# EAGLE design picostepknobs (EAGLE 9.6.2)
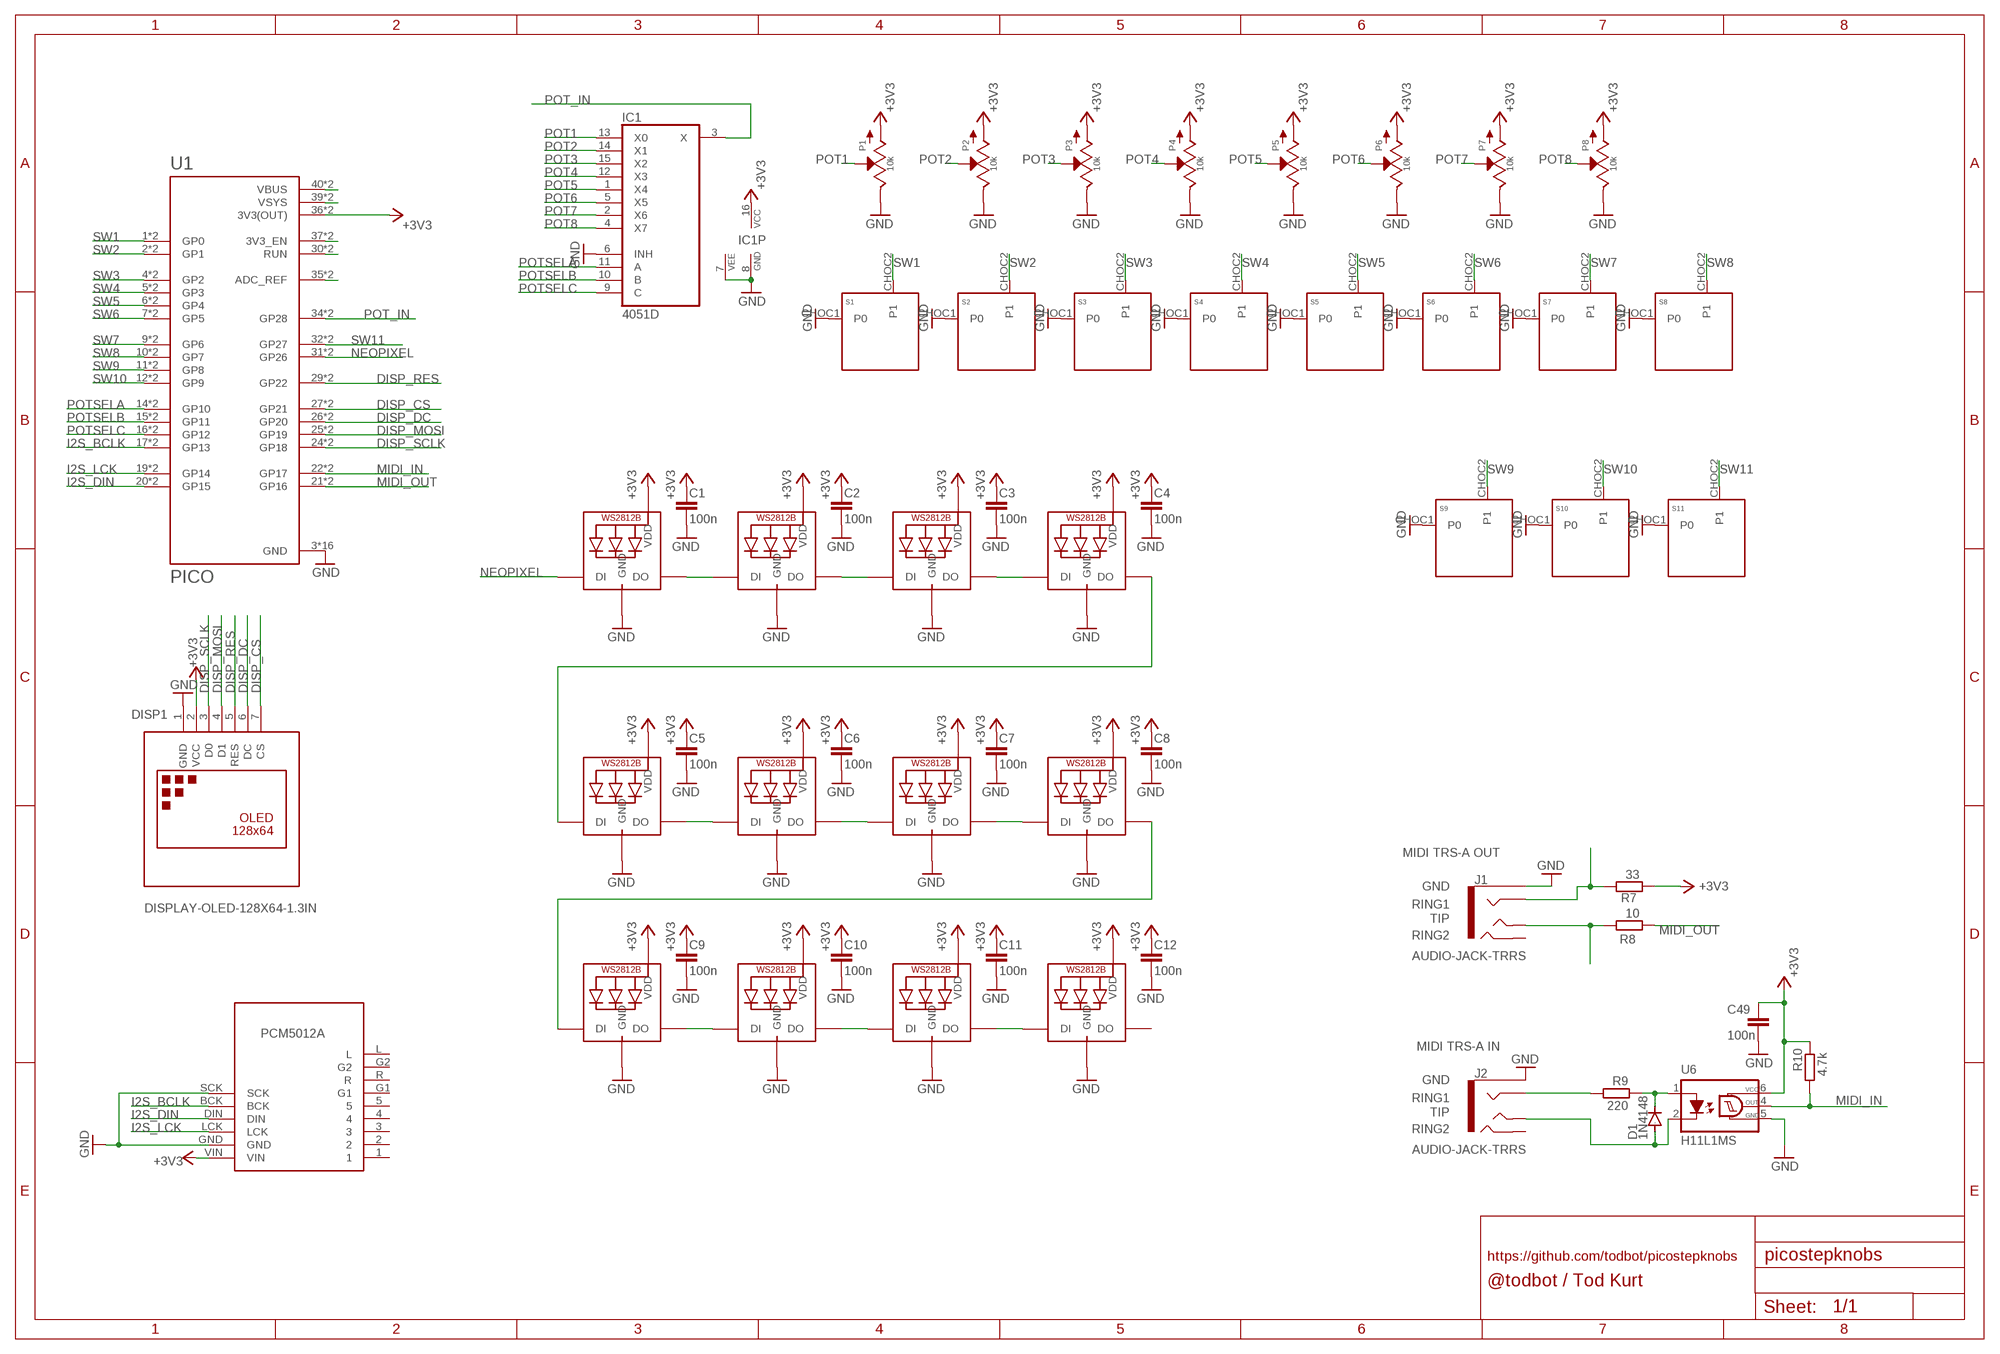
[diagram p0: schematic, sheet 1]

## Parts
C1  100n  C-EUC0805  [C0805]
C2  100n  C-EUC0805  [C0805]
C3  100n  C-EUC0805  [C0805]
C4  100n  C-EUC0805  [C0805]
C5  100n  C-EUC0805  [C0805]
C6  100n  C-EUC0805  [C0805]
C7  100n  C-EUC0805  [C0805]
C8  100n  C-EUC0805  [C0805]
C9  100n  C-EUC0805  [C0805]
C10  100n  C-EUC0805  [C0805]
C11  100n  C-EUC0805  [C0805]
C12  100n  C-EUC0805  [C0805]
C49  100n  C-EUC0805  [C0805]
D1  1N4148  DIODE-SOD123  [SOD123]
DISP1  DISPLAY-OLED-128X64-1.3IN  [DISPLAY-OLED-128X64-1.3IN]
IC1  4051D  [SO16]
J1  AUDIO-JACK-TRRS  [PJ-320D_SPARKFUN]
J2  AUDIO-JACK-TRRS  [PJ-320D_SPARKFUN]
LED1  WS2812B3535  [LED3535]
LED2  WS2812B3535  [LED3535]
LED3  WS2812B3535  [LED3535]
LED4  WS2812B3535  [LED3535]
LED5  WS2812B3535  [LED3535]
LED6  WS2812B3535  [LED3535]
LED7  WS2812B3535  [LED3535]
LED8  WS2812B3535  [LED3535]
LED9  WS2812B3535  [LED3535]
LED10  WS2812B3535  [LED3535]
LED11  WS2812B3535  [LED3535]
LED12  WS2812B3535  [LED3535]
P1  10k  POTZEPHPOT_BIGKNOB  [OG-POTS_ALPS_POT_VERTICAL_WITHBIGKNOB]
P2  10k  POTZEPHPOT_BIGKNOB  [OG-POTS_ALPS_POT_VERTICAL_WITHBIGKNOB]
P3  10k  POTZEPHPOT_BIGKNOB  [OG-POTS_ALPS_POT_VERTICAL_WITHBIGKNOB]
P4  10k  POTZEPHPOT_BIGKNOB  [OG-POTS_ALPS_POT_VERTICAL_WITHBIGKNOB]
P5  10k  POTZEPHPOT_BIGKNOB  [OG-POTS_ALPS_POT_VERTICAL_WITHBIGKNOB]
P6  10k  POTZEPHPOT_BIGKNOB  [OG-POTS_ALPS_POT_VERTICAL_WITHBIGKNOB]
P7  10k  POTZEPHPOT_BIGKNOB  [OG-POTS_ALPS_POT_VERTICAL_WITHBIGKNOB]
P8  10k  POTZEPHPOT_BIGKNOB  [OG-POTS_ALPS_POT_VERTICAL_WITHBIGKNOB]
PCM5102A  I2S_PCM_51XX_SOUNDCARD  [I2S_PCM_5100_SOUNDCARD]
R7  33  R-EU_R0805  [R0805]
R8  10  R-EU_R0805  [R0805]
R9  220  R-EU_R0805  [R0805]
R10  4.7k  R-EU_R0805  [R0805]
S1  KEYSWITCH-PLAIN-CHOC-1U  [CHOC-1U]
S2  KEYSWITCH-PLAIN-CHOC-1U  [CHOC-1U]
S3  KEYSWITCH-PLAIN-CHOC-1U  [CHOC-1U]
S4  KEYSWITCH-PLAIN-CHOC-1U  [CHOC-1U]
S5  KEYSWITCH-PLAIN-CHOC-1U  [CHOC-1U]
S6  KEYSWITCH-PLAIN-CHOC-1U  [CHOC-1U]
S7  KEYSWITCH-PLAIN-CHOC-1U  [CHOC-1U]
S8  KEYSWITCH-PLAIN-CHOC-1U  [CHOC-1U]
S9  KEYSWITCH-PLAIN-CHOC-1U  [CHOC-1U]
S10  KEYSWITCH-PLAIN-CHOC-1U  [CHOC-1U]
S11  KEYSWITCH-PLAIN-CHOC-1U  [CHOC-1U]
U1  PICO  RASPBERRY_PICO-NO_DEBUG  [PICO-PKG-NO_DEBUG]
U6  H11L1MS  [DIL6-SMD]

## Nets
+3V3: C1.1 C2.1 C3.1 C4.1 C5.1 C6.1 C7.1 C8.1 C9.1 C10.1 C11.1 C12.1 C49.1 DISP1.2(VCC) IC1.16(VCC) LED1.2(VDD) LED2.2(VDD) LED3.2(VDD) LED4.2(VDD) LED5.2(VDD) LED6.2(VDD) LED7.2(VDD) LED8.2(VDD) LED9.2(VDD) LED10.2(VDD) LED11.2(VDD) LED12.2(VDD) P1.P$3(A) P2.P$3(A) P3.P$3(A) P4.P$3(A) P5.P$3(A) P6.P$3(A) P7.P$3(A) P8.P$3(A) PCM5102A.VIN R7.2 R10.1 U1.36(3V3(OUT)) U1.P$36(3V3(OUT)) U6.6(VCC)
DISP_CS: DISP1.7(CS) U1.27(GP21) U1.P$27(GP21)
DISP_DC: DISP1.6(DC) U1.26(GP20) U1.P$26(GP20)
DISP_MOSI: DISP1.4(D1) U1.25(GP19) U1.P$25(GP19)
DISP_RES: DISP1.5(RES) U1.29(GP22) U1.P$29(GP22)
DISP_SCLK: DISP1.3(D0) U1.24(GP18) U1.P$24(GP18)
GND: C1.2 C2.2 C3.2 C4.2 C5.2 C6.2 C7.2 C8.2 C9.2 C10.2 C11.2 C12.2 C49.2 DISP1.1(GND) IC1.6(INH) IC1.7(VEE) IC1.8(GND) J1.EARTH J2.EARTH LED1.4(GND) LED2.4(GND) LED3.4(GND) LED4.4(GND) LED5.4(GND) LED6.4(GND) LED7.4(GND) LED8.4(GND) LED9.4(GND) LED10.4(GND) LED11.4(GND) LED12.4(GND) P1.P$1(E) P2.P$1(E) P3.P$1(E) P4.P$1(E) P5.P$1(E) P6.P$1(E) P7.P$1(E) P8.P$1(E) PCM5102A.GND PCM5102A.SCK S1.CHOC1(P0) S2.CHOC1(P0) S3.CHOC1(P0) S4.CHOC1(P0) S5.CHOC1(P0) S6.CHOC1(P0) S7.CHOC1(P0) S8.CHOC1(P0) S9.CHOC1(P0) S10.CHOC1(P0) S11.CHOC1(P0) U1.3(GND) U1.8(GND) U1.13(GND) U1.18(GND) U1.23(GND) U1.28(GND) U1.33(GND) U1.38(GND) U1.P$3(GND) U1.P$8(GND) U1.P$13(GND) U1.P$18(GND) U1.P$23(GND) U1.P$28(GND) U1.P$33(GND) U1.P$38(GND) U6.5(GND)
I2S_BCLK: PCM5102A.BCK U1.17(GP13) U1.P$17(GP13)
I2S_DIN: PCM5102A.DIN U1.20(GP15) U1.P$20(GP15)
I2S_LCK: PCM5102A.LCK U1.19(GP14) U1.P$19(GP14)
MIDI_IN: R10.2 U1.22(GP17) U1.P$22(GP17) U6.4(OUT)
MIDI_OUT: R8.2 U1.21(GP16) U1.P$21(GP16)
N$1: LED1.3(DO) LED2.1(DI)
N$2: LED2.3(DO) LED3.1(DI)
N$3: U1.37(3V3_EN) U1.P$37(3V3_EN)
N$4: LED3.3(DO) LED4.1(DI)
N$5: U1.30(RUN) U1.P$30(RUN)
N$6: U1.35(ADC_REF) U1.P$35(ADC_REF)
N$7: U1.40(VBUS) U1.P$40(VBUS)
N$8: U1.39(VSYS) U1.P$39(VSYS)
N$9: J1.TIP R8.1
N$10: LED4.3(DO) LED5.1(DI)
N$11: LED5.3(DO) LED6.1(DI)
N$12: LED6.3(DO) LED7.1(DI)
N$13: LED7.3(DO) LED8.1(DI)
N$14: LED9.3(DO) LED10.1(DI)
N$15: LED10.3(DO) LED11.1(DI)
N$16: LED11.3(DO) LED12.1(DI)
N$17: LED8.3(DO) LED9.1(DI)
N$38: J1.RING1 R7.1
N$47: D1.C R9.1 U6.1(A)
N$48: D1.A J2.TIP U6.2(C)
N$49: J2.RING1 R9.2
NEOPIXEL: LED1.1(DI) U1.31(GP26) U1.P$31(GP26)
POT1: IC1.13(X0) P1.P$2(S)
POT2: IC1.14(X1) P2.P$2(S)
POT3: IC1.15(X2) P3.P$2(S)
POT4: IC1.12(X3) P4.P$2(S)
POT5: IC1.1(X4) P5.P$2(S)
POT6: IC1.5(X5) P6.P$2(S)
POT7: IC1.2(X6) P7.P$2(S)
POT8: IC1.4(X7) P8.P$2(S)
POT_IN: IC1.3(X) U1.34(GP28) U1.P$34(GP28)
POTSELA: IC1.11(A) U1.14(GP10) U1.P$14(GP10)
POTSELB: IC1.10(B) U1.15(GP11) U1.P$15(GP11)
POTSELC: IC1.9(C) U1.16(GP12) U1.P$16(GP12)
SW1: S1.CHOC2(P1) U1.1(GP0) U1.P$1(GP0)
SW2: S2.CHOC2(P1) U1.2(GP1) U1.P$2(GP1)
SW3: S3.CHOC2(P1) U1.4(GP2) U1.P$4(GP2)
SW4: S4.CHOC2(P1) U1.5(GP3) U1.P$5(GP3)
SW5: S5.CHOC2(P1) U1.6(GP4) U1.P$6(GP4)
SW6: S6.CHOC2(P1) U1.7(GP5) U1.P$7(GP5)
SW7: S7.CHOC2(P1) U1.9(GP6) U1.P$9(GP6)
SW8: S8.CHOC2(P1) U1.10(GP7) U1.P$10(GP7)
SW9: S9.CHOC2(P1) U1.11(GP8) U1.P$11(GP8)
SW10: S10.CHOC2(P1) U1.12(GP9) U1.P$12(GP9)
SW11: S11.CHOC2(P1) U1.32(GP27) U1.P$32(GP27)
Unconnected: J1.RING2 J2.RING2 LED12.3(DO) PCM5102A.1 PCM5102A.2 PCM5102A.3 PCM5102A.4 PCM5102A.5 PCM5102A.G1 PCM5102A.G2 PCM5102A.L PCM5102A.R

## Notes on the sheet
- MIDI TRS-A OUT
- GND
- RING1
- TIP
- RING2
- PCM5012A
- MIDI TRS-A IN
- GND
- RING1
- TIP
- RING2
- https://github.com/todbot/picostepknobs
- @todbot / Tod Kurt

## Library data of the parts
C1-C12 C49 = rcl:C-EU: CAPACITOR, European symbol; SPICEPREFIX: C
D1 = diode:DIODE-: DIODE
DISP1 = todstuff:DISPLAY-OLED-128X64: 128x64 Dot Matrix OLED Module based on SSD1306 chip Variant with SPI interface More details available here: http://www.instructables.com/id/How-to-use-OLED-display-arduino-module/ SSD1306 datasheet: https://cdn-shop.adafruit.com/datasheets/SSD1306.pdf Click here to find device on ebay.com <http://www.ebay.com/sch/oled+display+128x64> Note: There are two variants: I2C and SPI. Search for the proper version.
IC1 = 40xx:4051: 8-channel ANALOG MULTIPLEXER
J1 J2 = audio_jacks_todbot:AUDIO-JACK-TRRS; LCSC: C431535; MPN: PJ-320D
LED1-LED12 = todstuff2023:WS2812B
P1-P8 = EurorackModularParts:POT
PCM5102A = PCM5102A:I2S_PCM_51XX_SOUNDCARD
R7-R10 = rcl:R-EU_: RESISTOR, European symbol; SPICEPREFIX: R
S1-S11 = Keyboard:KEYSWITCH-PLAIN
U1 = RpiPico:RASPBERRY_PICO-NO_DEBUG
U6 = optocoupler:H11L*M: 6-Pin DIP Optocoupler Source: http://www.fairchildsemi.com/ds/H1/H11L2-M.pdf; LCSC: C78589; MPN2: H11L1S; OC_FARNELL: unknown; OC_NEWARK: unknown

## Board
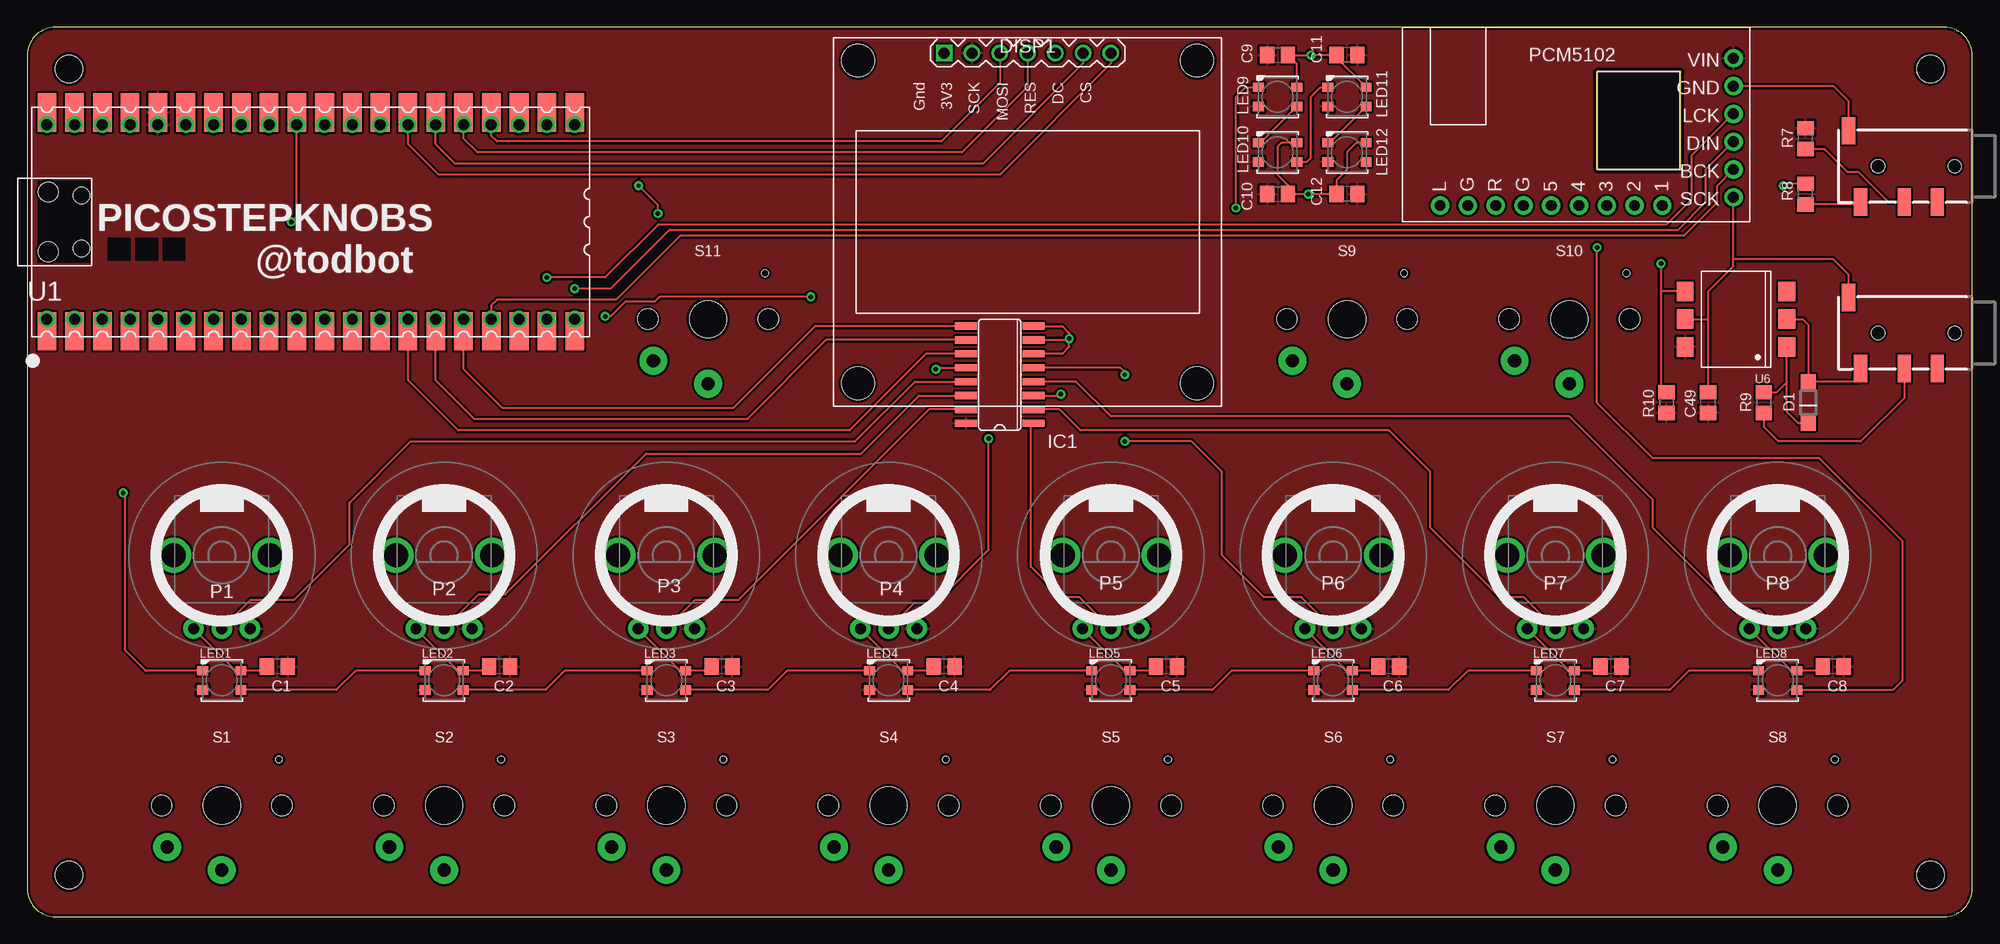
[diagram p1: board, top side]
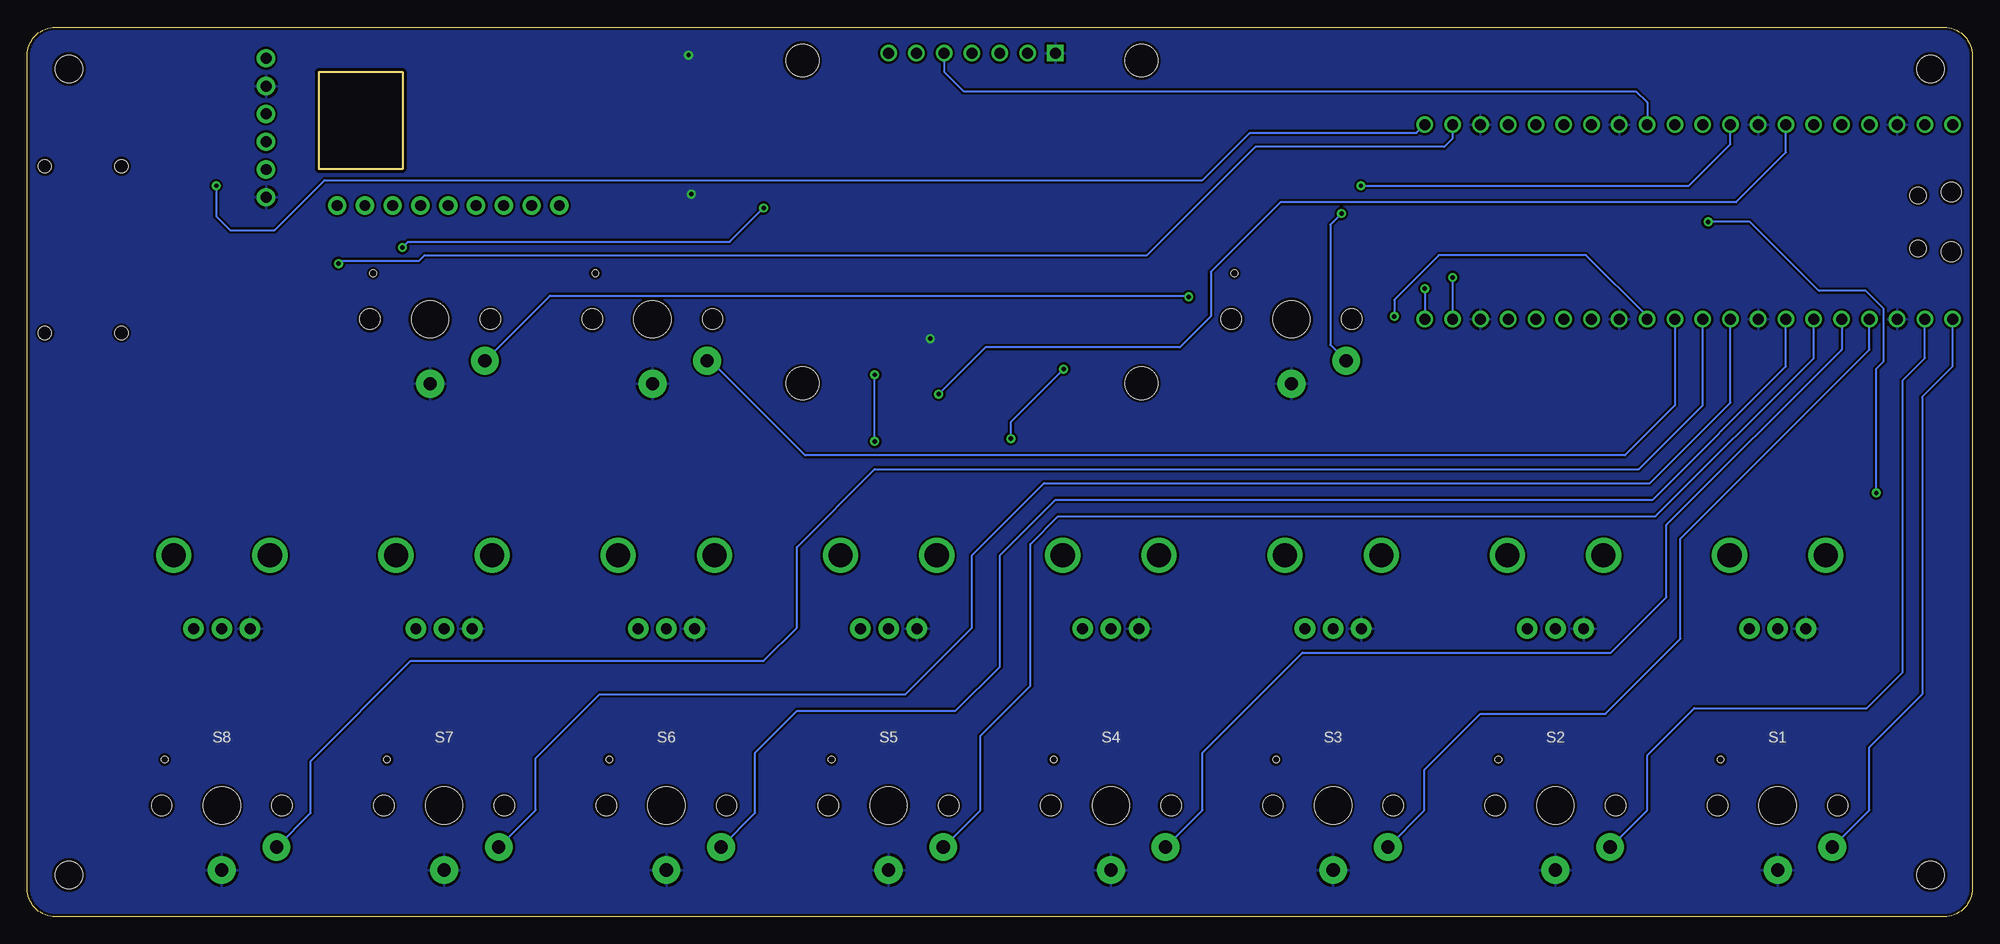
[diagram p2: board, bottom side, seen from below]

Size 177.8 x 81.28 mm. Coordinates in mm from the lower left corner, seen from the top.
Outline: 0,78.74 0,2.54 arc90 2.54,0 175.26,0 arc90 177.8,2.54 177.8,78.74 arc90 175.26,81.28 2.54,81.28 arc90 0,78.74
Outline: 151.13,77.22 143.51,77.22 143.51,68.33 151.13,68.33 151.13,77.22
Copper layers (1*16): Top 0.035mm / dielectric 1.5mm / Bottom 0.035mm
Design rules "adafruit-rules-20180530": minimum track width 8mil, minimum drill 16mil, track to track 8mil, track to pad 8mil, pad to pad 8mil, via to via 8mil, smd to smd 8mil, copper to edge 10mil, drill to drill 8mil, minimum pad ring 10mil, minimum via ring 8mil, stop-mask expansion 4mil, vias tented up to drill 20mil, thermal gap 10mil
Holes 2.54 mm at 3.81,3.81 173.99,3.81 173.99,77.47 3.81,77.47

### Footprints (pad centres in the part's own frame; a part is rotated, then mirrored left to right if it is on the bottom)
C0805 = smd 1.3 x 1.5: 1 -0.95,0; 2 0.95,0
SOD123 = smd 1.4 x 1.4: A 1.9,0; C -1.9,0
DISPLAY-OLED-128X64-1.3IN = drill 1 square: 1 -7.62,15.43 | drill 1: 2 -5.08,15.43; 3 -2.54,15.43; 4 0,15.43; 5 2.54,15.43; 6 5.08,15.43; 7 7.62,15.43 | hole 3: -15.5,14.75; 15.5,14.75; 15.5,-14.75; -15.5,-14.75
SO16 = smd 0.66 x 2.032: 1 -4.445,-3.073; 2 -3.175,-3.073; 3 -1.905,-3.073; 4 -0.635,-3.073; 5 0.635,-3.073; 6 1.905,-3.073; 7 3.175,-3.073; 8 4.445,-3.073; 9 4.445,3.073; 10 3.175,3.073; 11 1.905,3.073; 12 0.635,3.073; 13 -0.635,3.073; 14 -1.905,3.073; 15 -3.175,3.073; 16 -4.445,3.073
PJ-320D_SPARKFUN = smd 1.2 x 2.5: EARTH 11.3,-3.25; RING1 6.2,3.25; RING2 3.2,3.25; TIP 10.2,3.25 | hole 1.2: 1.6,0; 8.6,0
LED3535 = smd 1 x 0.85: 1 -1.75,0.875; 2 -1.75,-0.875; 3 1.75,-0.875; 4 1.75,0.875
OG-POTS_ALPS_POT_VERTICAL_WITHBIGKNOB = drill 1 pad 1.88: P$1 -2.58,-6.7; P$2 0,-6.7; P$3 2.58,-6.7 | drill 2.2 pad 3.175: P$4 4.4,0; P$5 -4.4,0
I2S_PCM_5100_SOUNDCARD = drill 1 pad 1.676: 1 1.5,8; 2 1.5,10.54; 3 1.5,13.08; 4 1.5,15.62; 5 1.5,18.16; BCK 4.79,1.5; DIN 7.33,1.5; G1 1.5,20.7; G2 1.5,25.78; GND 12.41,1.5; L 1.5,28.32; LCK 9.87,1.5; R 1.5,23.24; SCK 2.25,1.5; VIN 14.95,1.5
R0805 = smd 1.3 x 1.5: 1 -0.95,0; 2 0.95,0
CHOC-1U = drill 1.2 pad 2.54: CHOC1 0,5.9; CHOC2 5,3.8 | hole 3.4: 0,0 | hole 0.6: -5.22,-4.2 | hole 1.85: -5.5,0; 5.5,0
PICO-PKG-NO_DEBUG = drill 1: 1 -7.62,25.4; 2 -7.62,22.86; 3 -7.62,20.32; 4 -7.62,17.78; 5 -7.62,15.24; 6 -7.62,12.7; 7 -7.62,10.16; 8 -7.62,7.62; 9 -7.62,5.08; 10 -7.62,2.54; 11 -7.62,0; 12 -7.62,-2.54; 13 -7.62,-5.08; 14 -7.62,-7.62; 15 -7.62,-10.16; 16 -7.62,-12.7; 17 -7.62,-15.24; 18 -7.62,-17.78; 19 -7.62,-20.32; 20 -7.62,-22.86; 21 10.16,-22.86; 22 10.16,-20.32; 23 10.16,-17.78; 24 10.16,-15.24; 25 10.16,-12.7; 26 10.16,-10.16; 27 10.16,-7.62; 28 10.16,-5.08; 29 10.16,-2.54; 30 10.16,0; 31 10.16,2.54; 32 10.16,5.08; 33 10.16,7.62; 34 10.16,10.16; 35 10.16,12.7; 36 10.16,15.24; 37 10.16,17.78; 38 10.16,20.32; 39 10.16,22.86; 40 10.16,25.4 | smd 3.5 x 1.7: P$1 -8.73,25.4; P$2 -8.73,22.86; P$3 -8.73,20.32; P$4 -8.73,17.78; P$5 -8.73,15.24; P$6 -8.73,12.7; P$7 -8.73,10.16; P$8 -8.73,7.62; P$9 -8.73,5.08; P$10 -8.73,2.54; P$11 -8.73,0; P$12 -8.73,-2.54; P$13 -8.73,-5.08; P$14 -8.73,-7.62; P$15 -8.73,-10.16; P$16 -8.73,-12.7; P$17 -8.73,-15.24; P$18 -8.73,-17.78; P$19 -8.73,-20.32; P$20 -8.73,-22.86; P$21 11.27,-22.86; P$22 11.27,-20.32; P$23 11.27,-17.78; P$24 11.27,-15.24; P$25 11.27,-12.7; P$26 11.27,-10.16; P$27 11.27,-7.62; P$28 11.27,-5.08; P$29 11.27,-2.54; P$30 11.27,0; P$31 11.27,2.54; P$32 11.27,5.08; P$33 11.27,7.62; P$34 11.27,10.16; P$35 11.27,12.7; P$36 11.27,15.24; P$37 11.27,17.78; P$38 11.27,20.32; P$39 11.27,22.86; P$40 11.27,25.4 | hole 1.8: -1.455,25.27; 3.995,25.27 | hole 1.5: -1.155,22.24; 3.695,22.24
DIL6-SMD = smd 1.78 x 1.52: 1 -2.54,-4.645; 2 0,-4.645; 3 2.54,-4.645; 4 2.54,4.645; 5 0,4.645; 6 -2.54,4.645

### Placement (x,y rotation side)
C1  22.86,22.86 180 top
C2  43.18,22.86 180 top
C3  63.5,22.86 180 top
C4  83.82,22.86 180 top
C5  104.14,22.86 180 top
C6  124.46,22.86 180 top
C7  144.78,22.86 180 top
C8  165.1,22.86 180 top
C9  114.3,78.74 0 top
C10  114.3,66.04 0 top
C11  120.65,78.74 180 top
C12  120.65,66.04 180 top
C49  153.67,46.99 90 top
D1  162.81,46.99 90 top
DISP1  91.44,63.5 0 top
IC1  88.9,49.53 90 top
J1  177.8,68.58 180 top
J2  177.8,53.34 180 top
LED1  17.78,21.59 0 top
LED2  38.1,21.59 0 top
LED3  58.42,21.59 0 top
LED4  78.74,21.59 0 top
LED5  99.06,21.59 0 top
LED6  119.38,21.59 0 top
LED7  139.7,21.59 0 top
LED8  160.02,21.59 0 top
LED9  114.3,74.93 0 top
LED10  114.3,69.85 0 top
LED11  120.65,74.93 0 top
LED12  120.65,69.85 0 top
P1  17.78,33.02 0 top
P2  38.1,33.02 0 top
P3  58.42,33.02 0 top
P4  78.74,33.02 0 top
P5  99.06,33.02 0 top
P6  119.38,33.02 0 top
P7  139.7,33.02 0 top
P8  160.02,33.02 0 top
PCM5102A  157.48,63.5 90 top
R7  162.56,71.12 90 top
R8  162.56,66.04 90 top
R9  158.75,46.99 270 top
R10  149.86,46.99 90 top
S1  17.78,10.16 180 top
S2  38.1,10.16 180 top
S3  58.42,10.16 180 top
S4  78.74,10.16 180 top
S5  99.06,10.16 180 top
S6  119.38,10.16 180 top
S7  139.7,10.16 180 top
S8  160.02,10.16 180 top
S9  120.65,54.61 180 top
S10  140.97,54.61 180 top
S11  62.23,54.61 180 top
U1  27.18,62.23 90 top
U6  156.21,54.61 90 top

### Tracks (layer width: path | path; a pad name or v marks a point on that pad's centre or on a via)
+3V3
  Top 0.203: U1.P$36 U1.36
  pour Top: 178.06,81.36 178.06,0.25 -0.4,0.25 -0.4,81.36
DISP_CS
  Top 0.203: U1.P$27 U1.27 34.8,70.61 37.59,67.82 88.9,67.82 99.06,77.98 DISP1.7
DISP_DC
  Top 0.203: U1.P$26 U1.26 37.34,70.61 39.12,68.83 87.38,68.83 96.52,77.98 DISP1.6
DISP_MOSI
  Top 0.203: U1.P$25 U1.25 39.88,71.12 41.15,69.85 85.45,69.85 91.44,75.84 DISP1.4
DISP_RES
  Top 0.203: U1.P$29 U1.29
  Bottom 0.203: DISP1.5 93.98,77.22 92.2,75.44 30.73,75.44 29.72,74.42 U1.29
DISP_SCLK
  Top 0.203: U1.P$24 U1.24 42.42,71.37 42.93,70.87 83.57,70.87 88.9,76.2 DISP1.3
GND  (via drill 0.41)
  Top 0.203: C1.2 21.52,22.46 LED1.4 19.05,22.46 P1.P$1 | C2.2 41.84,22.46 LED2.4 39.38,22.46 P2.P$1 | C3.2 62.16,22.46 LED3.4 59.7,22.46 P3.P$1 | C4.2 82.47,22.46 LED4.4 80.02,22.46 P4.P$1 | C5.2 102.8,22.46 LED5.4 100.33,22.46 P5.P$1 | C6.2 123.11,22.46 LED6.4 120.66,22.46 P6.P$1 | C7.2 143.44,22.46 LED7.4 140.97,22.46 P7.P$1 | C8.2 163.75,22.46 LED8.4 161.29,22.46 P8.P$1 | U1.P$23 U1.23 | U1.P$28 U1.28 | U1.P$38 U1.38 | U1.P$33 U1.33 | U1.P$3 U1.3 | U1.P$8 U1.8 | U1.P$18 U1.18 | U1.P$13 U1.13 | J1.EARTH 166.5,74.55 165.14,75.91 PCM5102A.GND | IC1.8 94.61,53.98 95.25,53.34 v95.25,52.83 | v95.25,52.83 95.25,52.07 94.61,51.44 IC1.6 | IC1.7 95.12,52.7 v95.25,52.83 | 155.98,60.07 155.98,59.46 153.67,57.15 153.67,54.61 | 155.98,60.07 PCM5102A.SCK | J2.EARTH 166.5,58.67 165.1,60.07 155.98,60.07 | C49.2 153.67,54.61 | U6.5 153.67,54.61 | 122.47,75.88 LED11.4 119.47,78.74 | 122.47,70.8 LED12.4 121.53,70.72 120.65,69.85 120.65,68.26 119.7,67.31 C12.2 v117.09,66.04 C10.2 115.25,66.87 114.3,67.82 114.3,70.36 114.67,70.72 LED10.4 | LED9.4 116.05,77.94 C9.2 v117.35,78.74 119.47,78.74 | C11.2 119.47,78.74
  pour Bottom: 0,86.17 180.34,86.17 180.34,0.25 0,0.25
I2S_BCLK
  Top 0.203: U1.17 U1.P$17 42.42,55.88 42.93,56.39 53.85,56.39 59.69,62.23 151.44,62.23 154.46,65.25 154.46,66.77 PCM5102A.BCK
I2S_DIN  (via drill 0.41)
  Top 0.203: U1.P$20 U1.20 | PCM5102A.DIN 153.42,68.27 153.42,65.28 150.88,62.74 58.67,62.74 53.34,57.4 v50.04,57.4
  Bottom 0.203: v50.04,57.4 U1.20
I2S_LCK  (via drill 0.41)
  Top 0.203: U1.P$19 U1.19 | PCM5102A.LCK 152.15,69.54 152.15,65.53 149.86,63.25 57.66,63.25 52.83,58.42 v47.5,58.42
  Bottom 0.203: v47.5,58.42 U1.19
MIDI_IN  (via drill 0.41)
  Top 0.203: U1.P$22 U1.22 | v149.35,59.69 149.35,57.15 | 149.35,57.15 149.35,48.45 R10.2 | U6.4 149.35,57.15
  Bottom 0.203: v149.35,59.69 149.1,59.94 141.99,59.94 141.48,60.45 75.44,60.45 65.53,70.36 48.26,70.36 47.5,71.12 U1.22
MIDI_OUT  (via drill 0.41)
  Top 0.203: U1.P$21 U1.21 | R8.2 160.72,66.99 v160.53,66.8
  Bottom 0.203: U1.21 50.8,71.63 66.04,71.63 70.36,67.31 150.62,67.31 155.19,62.74 159.26,62.74 160.53,64.01 v160.53,66.8
N$1
  Top 0.203: LED2.1 30,22.46 28.25,20.71 LED1.3
N$2
  Top 0.203: LED3.1 49.13,22.46 47.38,20.71 LED2.3
N$3
  Top 0.203: U1.P$37 U1.37
N$4
  Top 0.203: LED4.1 69.45,22.46 67.7,20.71 LED3.3
N$5
  Top 0.203: U1.P$30 U1.30
N$6
  Top 0.203: U1.P$35 U1.35
N$7
  Top 0.203: U1.P$40 U1.40
N$8
  Top 0.203: U1.P$39 U1.39
N$9
  Top 0.203: J1.TIP 167.36,65.09 R8.1
N$10
  Top 0.203: LED5.1 89.78,22.46 88.03,20.71 LED4.3
N$11
  Top 0.203: LED6.1 110.09,22.46 108.34,20.71 LED5.3
N$12
  Top 0.203: LED7.1 131.69,22.46 129.94,20.71 LED6.3
N$13
  Top 0.203: LED8.1 151.92,22.46 150.17,20.71 LED7.3
N$14
  Top 0.203: LED9.3 112.72,70.72 LED10.1
N$15
  Top 0.203: LED10.3 116.98,68.97 117.35,69.34 117.35,74.93 118.22,75.81 LED11.1
N$16
  Top 0.203: LED11.3 119.07,70.72 LED12.1
N$17  (via drill 0.41)
  Top 0.203: LED8.3 170.57,20.71 171.45,21.59 171.45,34.29 163.83,41.91 148.59,41.91 143.51,46.99 v143.51,61.16 | v110.49,64.77 110.49,74.93 111.36,75.81 LED9.1
  Bottom 0.203: v143.51,61.16 143,61.67 113.59,61.67 v110.49,64.77
N$38
  Top 0.203: J1.RING1 170.43,65.33 170.13,65.33 167.39,68.07 166.37,68.07 164.27,70.17 R7.1
N$47
  Top 0.203: R9.1 159.95,47.94 160.85,48.84 | 160.85,48.84 U6.1 | D1.C 161.92,45.09 160.85,46.16 160.85,48.84
N$48
  Top 0.203: J2.TIP 167.6,49.07 167.42,48.89 D1.A 162.81,54.1 162.31,54.61 U6.2
N$49
  Top 0.203: J2.RING1 171.6,47.39 167.64,43.43 160.09,43.43 158.75,44.77 R9.2
NEOPIXEL  (via drill 0.41)
  Top 0.203: LED1.1 10.81,22.46 8.89,24.38 8.89,38.61 v8.76,38.73 | U1.P$31 U1.31 24.64,64.01 v24.13,63.5
  Bottom 0.203: v8.76,38.73 8.76,50.1 8.09,50.78 8.09,55.56 9.72,57.19 14.01,57.19 20.32,63.5 v24.13,63.5
POT1
  Top 0.203: P1.P$2 20.42,28.96 24.38,28.96 29.46,34.04 29.46,37.85 35.05,43.43 75.69,43.43 81.15,48.9 IC1.13
POT2
  Top 0.203: P2.P$2 41.24,29.46 43.69,29.46 56.55,42.32 76.2,42.32 81.5,47.62 IC1.14
POT3
  Top 0.203: P3.P$2 61.06,28.96 65.02,28.96 82.42,46.35 IC1.15
POT4  (via drill 0.41)
  Top 0.203: P4.P$2 81.12,28.7 83.06,28.7 87.88,33.53 v87.88,43.69 | v83.06,50.04 83.19,50.16 IC1.12
  Bottom 0.203: v87.88,43.69 87.88,45.21 v83.06,50.04
POT5
  Top 0.203: P5.P$2 96.17,29.21 94.49,29.21 91.69,32 91.69,44.81 IC1.1
POT6  (via drill 0.41)
  Top 0.203: P6.P$2 116.49,29.21 113.03,29.21 109.22,33.02 109.22,40.64 106.43,43.43 v100.33,43.43 | v100.33,49.53 100.33,49.78 99.95,50.16 IC1.5
  Bottom 0.203: v100.33,43.43 v100.33,49.53
POT7
  Top 0.203: P7.P$2 136.81,29.21 134.62,29.21 128.27,35.56 128.27,40.64 124.46,44.45 96.27,44.45 94.36,46.35 IC1.2
POT8
  Top 0.203: P8.P$2 158.4,27.94 156.21,27.94 148.59,35.56 148.59,38.1 140.97,45.72 99.06,45.72 95.89,48.9 IC1.4
POT_IN  (via drill 0.41)
  Top 0.203: U1.P$34 U1.34 | IC1.3 94.36,47.62 v94.49,47.75
  Bottom 0.203: v94.49,47.75 94.48,47.75 90.21,52.02 72.44,52.02 69.6,54.86 69.6,58.93 63.25,65.28 21.59,65.28 17.02,69.85 U1.34
POTSELA
  Top 0.203: U1.14 U1.P$14 34.8,49.02 39.37,44.45 75.18,44.45 82.17,51.44 IC1.11
POTSELB
  Top 0.203: U1.15 U1.P$15 37.34,49.02 40.89,45.47 65.79,45.47 73.03,52.7 IC1.10
POTSELC
  Top 0.203: U1.16 U1.P$16 39.88,50.04 43.43,46.48 64.52,46.48 72.01,53.98 IC1.9
SW1
  Top 0.203: U1.P$1 U1.1
  Bottom 0.203: U1.1 1.78,50.29 4.57,47.5 4.57,20.32 9.4,15.49 9.4,9.74 S1.CHOC2
SW2
  Top 0.203: U1.P$2 U1.2
  Bottom 0.203: S2.CHOC2 29.72,9.74 29.72,14.73 25.4,19.05 9.65,19.05 6.35,22.35 6.35,49.02 4.32,51.05 U1.2
SW3
  Top 0.203: U1.P$4 U1.4
  Bottom 0.203: U1.4 9.4,51.82 26.67,34.54 26.67,25.4 33.53,18.54 44.96,18.54 50.08,13.42 50.08,9.7 S3.CHOC2
SW4
  Top 0.203: U1.P$5 U1.5
  Bottom 0.203: U1.5 11.94,51.82 27.94,35.81 27.94,29.21 33.02,24.13 61.21,24.13 70.36,14.99 70.36,9.74 S4.CHOC2
SW5
  Top 0.203: U1.P$6 U1.6
  Bottom 0.203: S5.CHOC2 90.68,9.74 90.68,16.51 86.11,21.08 86.11,34.04 83.57,36.58 28.96,36.58 14.48,51.05 U1.6
SW6
  Top 0.203: U1.P$7 U1.7
  Bottom 0.203: S6.CHOC2 111.25,9.49 111.25,14.99 107.44,18.8 92.96,18.8 88.9,22.86 88.9,33.02 83.82,38.1 29.21,38.1 17.02,50.29 U1.7
SW7
  Top 0.203: U1.P$9 U1.9
  Bottom 0.203: S7.CHOC2 131.32,9.74 131.32,14.48 125.48,20.32 97.54,20.32 91.44,26.42 91.44,33.02 84.84,39.62 29.46,39.62 22.1,46.99 U1.9
SW8
  Top 0.203: U1.P$10 U1.10
  Bottom 0.203: S8.CHOC2 151.89,9.49 151.89,14.22 142.75,23.37 110.49,23.37 107.44,26.42 107.44,33.78 100.33,40.89 30.48,40.89 24.64,46.74 U1.10
SW9
  Top 0.203: U1.P$11 U1.11
  Bottom 0.203: U1.11 27.18,46.74 31.75,42.16 106.68,42.16 115.33,50.81 S9.CHOC2
SW10  (via drill 0.41)
  Top 0.203: U1.P$12 U1.12 | v52.83,54.86 53.34,54.86 54.71,56.24 57.39,56.24 57.82,56.67 71.6,56.67 v71.63,56.64
  Bottom 0.203: v71.63,56.64 71.75,56.77 130.01,56.77 S10.CHOC2 | U1.12 29.72,54.86 35.31,60.45 48.76,60.45 52.83,56.38 v52.83,54.86
SW11  (via drill 0.41)
  Top 0.203: U1.P$32 U1.32 | v57.66,64.26 57.66,65.02 v55.88,66.8
  Bottom 0.203: v55.88,66.8 25.91,66.8 22.1,70.61 U1.32 | S11.CHOC2 58.67,52.25 58.67,63.25 v57.66,64.26

### Text on the board
tPlace: PCM5102 | Gnd | 3V3 | SCK | MOSI | RES | DC | CS | PICOSTEPKNOBS | @todbot